# Altium schematic sheet VALVES.SchDoc
size A3; SheetNumber: 3; SheetTotal: 9
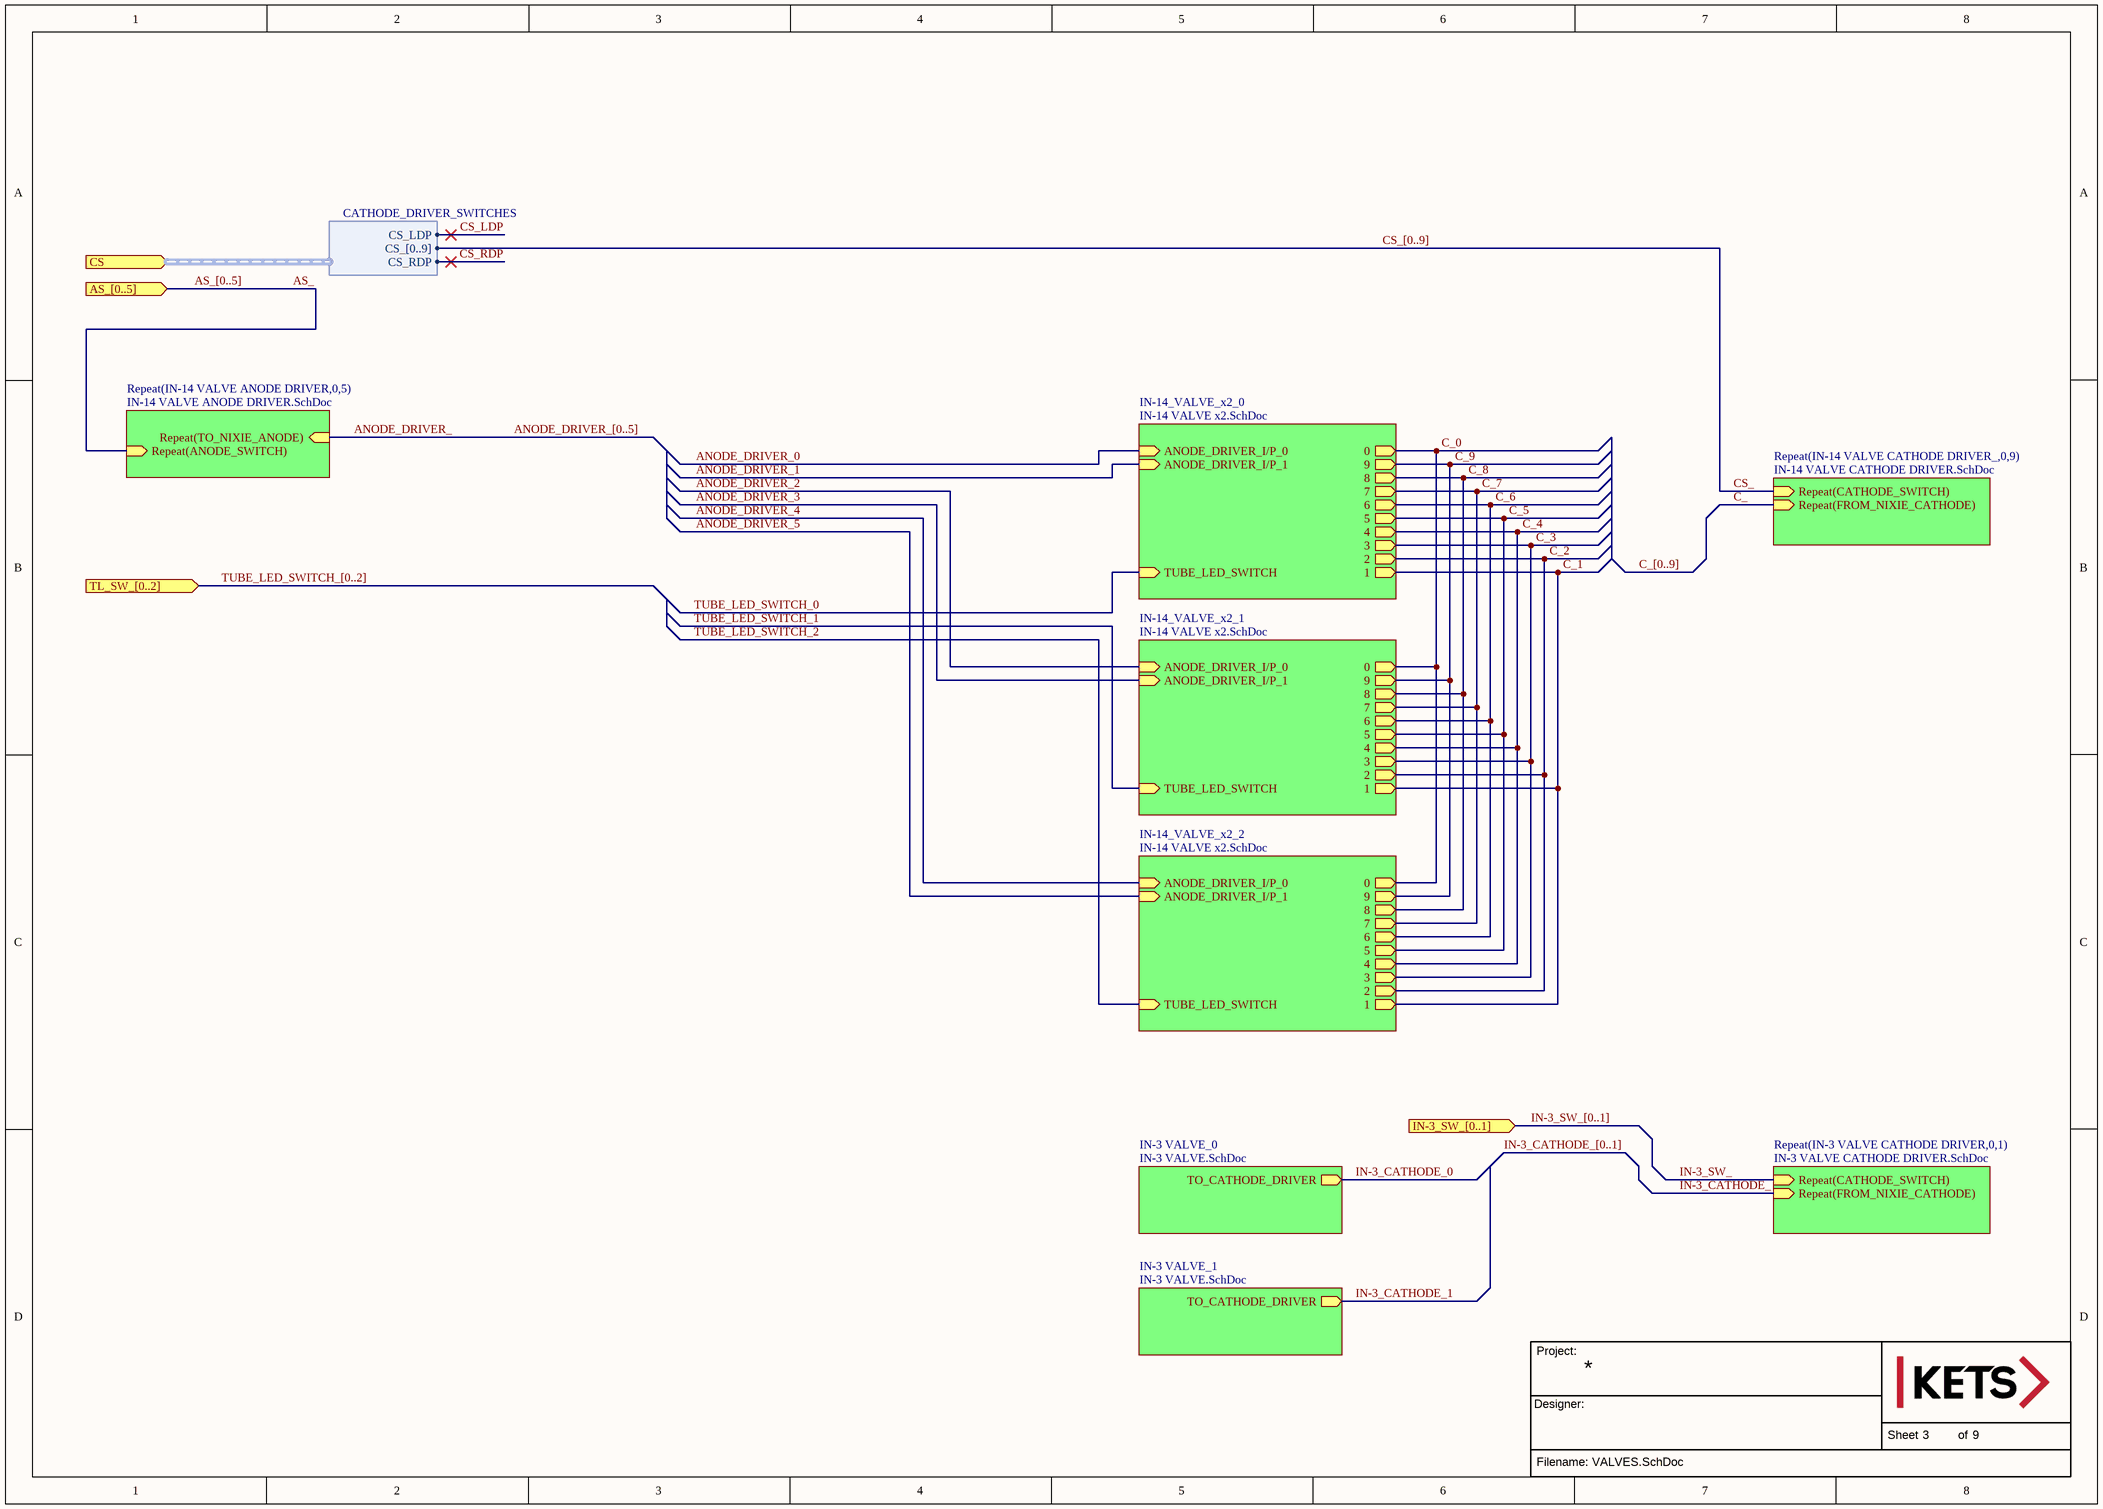
[diagram p0: VALVES.SchDoc]

## Parts
?  (no value)

## Sub-sheets
IN-3 VALVE_0 = IN-3 VALVE.SchDoc: TO_CATHODE_DRIVER (out)
IN-3 VALVE_1 = IN-3 VALVE.SchDoc: TO_CATHODE_DRIVER (out)
IN-14_VALVE_x2_0 = IN-14 VALVE x2.SchDoc: ANODE_DRIVER_I/P_0 (in), ANODE_DRIVER_I/P_1 (in), TUBE_LED_SWITCH (in), 0 (out), 9 (out), 8 (out), 7 (out), 6 (out), 5 (out), 4 (out), 3 (out), 2 (out), 1 (out)
IN-14_VALVE_x2_1 = IN-14 VALVE x2.SchDoc: ANODE_DRIVER_I/P_0 (in), ANODE_DRIVER_I/P_1 (in), TUBE_LED_SWITCH (in), 0 (out), 9 (out), 8 (out), 7 (out), 6 (out), 5 (out), 4 (out), 3 (out), 2 (out), 1 (out)
IN-14_VALVE_x2_2 = IN-14 VALVE x2.SchDoc: ANODE_DRIVER_I/P_0 (in), ANODE_DRIVER_I/P_1 (in), TUBE_LED_SWITCH (in), 0 (out), 9 (out), 8 (out), 7 (out), 6 (out), 5 (out), 4 (out), 3 (out), 2 (out), 1 (out)
Repeat(IN-3 VALVE CATHODE DRIVER,0,1) = IN-3 VALVE CATHODE DRIVER.SchDoc: Repeat(CATHODE_SWITCH) (in), Repeat(FROM_NIXIE_CATHODE) (in)
Repeat(IN-14 VALVE ANODE DRIVER,0,5) = IN-14 VALVE ANODE DRIVER.SchDoc: Repeat(ANODE_SWITCH) (in), Repeat(TO_NIXIE_ANODE) (in)
Repeat(IN-14 VALVE CATHODE DRIVER_,0,9) = IN-14 VALVE CATHODE DRIVER.SchDoc: Repeat(CATHODE_SWITCH) (in), Repeat(FROM_NIXIE_CATHODE) (in)

## Ports
AS_[0..5] (in), CS (in, harness CATHODE_DRIVER_SWITCHES), IN-3_SW_[0..1] (in), TL_SW_[0..2] (in)

## Harnesses
CATHODE_DRIVER_SWITCHES: CS_LDP, CS_[0..9], CS_RDP

## Nets
ANODE_DRIVER_: sheet Repeat(IN-14 VALVE ANODE DRIVER,0,5)/Repeat(TO_NIXIE_ANODE)
ANODE_DRIVER_0: sheet IN-14_VALVE_x2_0/ANODE_DRIVER_I/P_0
ANODE_DRIVER_1: sheet IN-14_VALVE_x2_0/ANODE_DRIVER_I/P_1
ANODE_DRIVER_2: sheet IN-14_VALVE_x2_1/ANODE_DRIVER_I/P_0
ANODE_DRIVER_3: sheet IN-14_VALVE_x2_1/ANODE_DRIVER_I/P_1
ANODE_DRIVER_4: sheet IN-14_VALVE_x2_2/ANODE_DRIVER_I/P_0
ANODE_DRIVER_5: sheet IN-14_VALVE_x2_2/ANODE_DRIVER_I/P_1
AS_: sheet Repeat(IN-14 VALVE ANODE DRIVER,0,5)/Repeat(ANODE_SWITCH)
C_: sheet Repeat(IN-14 VALVE CATHODE DRIVER_,0,9)/Repeat(FROM_NIXIE_CATHODE)
C_0: sheet IN-14_VALVE_x2_0/0, sheet IN-14_VALVE_x2_1/0, sheet IN-14_VALVE_x2_2/0
C_1: sheet IN-14_VALVE_x2_0/1, sheet IN-14_VALVE_x2_1/1, sheet IN-14_VALVE_x2_2/1
C_2: sheet IN-14_VALVE_x2_0/2, sheet IN-14_VALVE_x2_1/2, sheet IN-14_VALVE_x2_2/2
C_3: sheet IN-14_VALVE_x2_0/3, sheet IN-14_VALVE_x2_1/3, sheet IN-14_VALVE_x2_2/3
C_4: sheet IN-14_VALVE_x2_0/4, sheet IN-14_VALVE_x2_1/4, sheet IN-14_VALVE_x2_2/4
C_5: sheet IN-14_VALVE_x2_0/5, sheet IN-14_VALVE_x2_1/5, sheet IN-14_VALVE_x2_2/5
C_6: sheet IN-14_VALVE_x2_0/6, sheet IN-14_VALVE_x2_1/6, sheet IN-14_VALVE_x2_2/6
C_7: sheet IN-14_VALVE_x2_0/7, sheet IN-14_VALVE_x2_1/7, sheet IN-14_VALVE_x2_2/7
C_8: sheet IN-14_VALVE_x2_0/8, sheet IN-14_VALVE_x2_1/8, sheet IN-14_VALVE_x2_2/8
C_9: sheet IN-14_VALVE_x2_0/9, sheet IN-14_VALVE_x2_1/9, sheet IN-14_VALVE_x2_2/9
CS_: sheet Repeat(IN-14 VALVE CATHODE DRIVER_,0,9)/Repeat(CATHODE_SWITCH)
CS_LDP: port CS.CS_LDP
CS_RDP: port CS.CS_RDP
IN-3_CATHODE_: sheet Repeat(IN-3 VALVE CATHODE DRIVER,0,1)/Repeat(FROM_NIXIE_CATHODE)
IN-3_CATHODE_0: sheet IN-3 VALVE_0/TO_CATHODE_DRIVER
IN-3_CATHODE_1: sheet IN-3 VALVE_1/TO_CATHODE_DRIVER
IN-3_SW_: sheet Repeat(IN-3 VALVE CATHODE DRIVER,0,1)/Repeat(CATHODE_SWITCH)
TUBE_LED_SWITCH_0: sheet IN-14_VALVE_x2_0/TUBE_LED_SWITCH
TUBE_LED_SWITCH_1: sheet IN-14_VALVE_x2_1/TUBE_LED_SWITCH
TUBE_LED_SWITCH_2: sheet IN-14_VALVE_x2_2/TUBE_LED_SWITCH

## Buses and harness runs
bus ANODE_DRIVER_[0..5]
bus AS_[0..5] = port AS_[0..5]
bus C_[0..9]
bus CS_[0..9]
bus IN-3_CATHODE_[0..1]
bus IN-3_SW_[0..1] = port IN-3_SW_[0..1]
bus TUBE_LED_SWITCH_[0..2] = port TL_SW_[0..2]

## Notes on the sheet
- Project:
- Designer:
- Sheet
- of
- Filename:

## Library data of the parts
? = CMP-00003-4: The KETS Schematic Sheet Title Block